# Altium schematic sheet ArcadeJoystick.SchDoc
size A
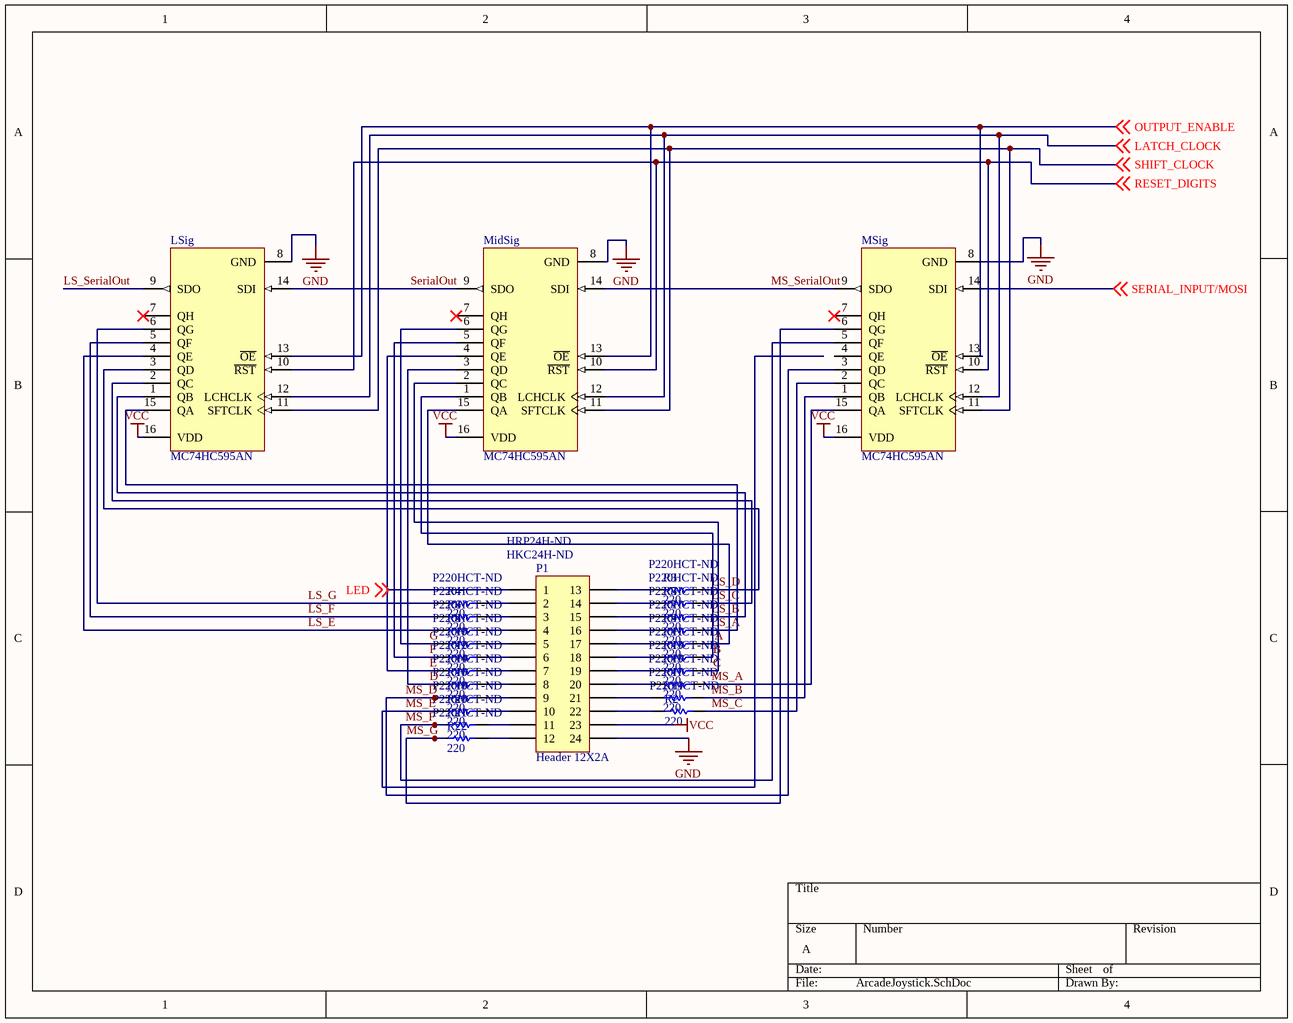
[diagram p0: ArcadeJoystick.SchDoc]

## Parts
LSig  MC74HC595AN  [648-08]
MidSig  MC74HC595AN  [648-08]
MSig  MC74HC595AN  [648-08]
P1  Header 12X2A  Supplier Part Number 1: HKC24H-ND  Supplier Part Number 2: HRP24H-ND  [HDR2X12_CEN]
R2  value 220  Supplier Part Number 1: P220HCT-ND  [1608[0603]]  (hidden comment: Res Semi)
R3  value 220  Supplier Part Number 1: P220HCT-ND  [1608[0603]]  (hidden comment: Res Semi)
R4  value 220  Supplier Part Number 1: P220HCT-ND  [1608[0603]]  (hidden comment: Res Semi)
R5  value 220  Supplier Part Number 1: P220HCT-ND  [1608[0603]]  (hidden comment: Res Semi)
R6  value 220  Supplier Part Number 1: P220HCT-ND  [1608[0603]]  (hidden comment: Res Semi)
R7  value 220  Supplier Part Number 1: P220HCT-ND  [1608[0603]]  (hidden comment: Res Semi)
R8  value 220  Supplier Part Number 1: P220HCT-ND  [1608[0603]]  (hidden comment: Res Semi)
R9  value 220  Supplier Part Number 1: P220HCT-ND  [1608[0603]]  (hidden comment: Res Semi)
R10  value 220  Supplier Part Number 1: P220HCT-ND  [1608[0603]]  (hidden comment: Res Semi)
R11  value 220  Supplier Part Number 1: P220HCT-ND  [1608[0603]]  (hidden comment: Res Semi)
R12  value 220  Supplier Part Number 1: P220HCT-ND  [1608[0603]]  (hidden comment: Res Semi)
R13  value 220  Supplier Part Number 1: P220HCT-ND  [1608[0603]]  (hidden comment: Res Semi)
R14  value 220  Supplier Part Number 1: P220HCT-ND  [1608[0603]]  (hidden comment: Res Semi)
R15  value 220  Supplier Part Number 1: P220HCT-ND  [1608[0603]]  (hidden comment: Res Semi)
R16  value 220  Supplier Part Number 1: P220HCT-ND  [1608[0603]]  (hidden comment: Res Semi)
R17  value 220  Supplier Part Number 1: P220HCT-ND  [1608[0603]]  (hidden comment: Res Semi)
R18  value 220  Supplier Part Number 1: P220HCT-ND  [1608[0603]]  (hidden comment: Res Semi)
R19  value 220  Supplier Part Number 1: P220HCT-ND  [1608[0603]]  (hidden comment: Res Semi)
R20  value 220  Supplier Part Number 1: P220HCT-ND  [1608[0603]]  (hidden comment: Res Semi)
R21  value 220  Supplier Part Number 1: P220HCT-ND  [1608[0603]]  (hidden comment: Res Semi)
R22  value 220  Supplier Part Number 1: P220HCT-ND  [1608[0603]]  (hidden comment: Res Semi)

## Nets
GND: LSig.8(GND) MidSig.8(GND) MSig.8(GND) P1.24
VCC: LSig.16(VDD) MidSig.16(VDD) MSig.16(VDD) P1.23
A: MidSig.15(QA) R11.2
B: MidSig.1(QB) R13.2
C: MidSig.2(QC) R15.2
D: MidSig.3(QD) R16.1
E: MidSig.4(QE) R14.1
F: MidSig.5(QF) R12.1
G: MidSig.6(QG) R10.1
LATCH_CLOCK: LSig.12(LCHCLK) MidSig.12(LCHCLK) MSig.12(LCHCLK) ; off-sheet LATCH_CLOCK
LED: P1.1 ; off-sheet LED
LS_A: LSig.15(QA) R9.2
LS_B: LSig.1(QB) R7.2
LS_C: LSig.2(QC) R5.2
LS_D: LSig.3(QD) R3.2
LS_E: LSig.4(QE) R8.1
LS_F: LSig.5(QF) R6.1
LS_G: LSig.6(QG) R4.1
LS_SerialOut: LSig.9(SDO)
MS_A: MSig.15(QA) R17.2
MS_B: MSig.1(QB) R19.2
MS_C: MSig.2(QC) R2.2
MS_D: MSig.3(QD) R18.1
MS_E: R20.1
MS_F: MSig.5(QF) R21.1
MS_G: MSig.6(QG) R22.1
MS_SerialOut: MidSig.14(SDI) MSig.9(SDO)
OUTPUT_ENABLE: LSig.13(~{OE}) MidSig.13(~{OE}) MSig.13(~{OE}) ; off-sheet OUTPUT_ENABLE
RESET_DIGITS: LSig.10(~{RST}) MidSig.10(~{RST}) MSig.10(~{RST}) ; off-sheet RESET_DIGITS
SERIAL_INPUT/MOSI: MSig.14(SDI) ; off-sheet SERIAL_INPUT/MOSI
SerialOut: LSig.14(SDI) MidSig.9(SDO)
SHIFT_CLOCK: LSig.11(SFTCLK) MidSig.11(SFTCLK) MSig.11(SFTCLK) ; off-sheet SHIFT_CLOCK
NetP1_2: P1.2 R4.2
NetP1_3: P1.3 R6.2
NetP1_4: P1.4 R8.2
NetP1_5: P1.5 R10.2
NetP1_6: P1.6 R12.2
NetP1_7: P1.7 R14.2
NetP1_8: P1.8 R16.2
NetP1_9: P1.9 R18.2
NetP1_10: P1.10 R20.2
NetP1_11: P1.11 R21.2
NetP1_12: P1.12 R22.2
NetP1_13: P1.13 R3.1
NetP1_14: P1.14 R5.1
NetP1_15: P1.15 R7.1
NetP1_16: P1.16 R9.1
NetP1_17: P1.17 R11.1
NetP1_18: P1.18 R13.1
NetP1_19: P1.19 R15.1
NetP1_20: P1.20 R17.1
NetP1_21: P1.21 R19.1
NetP1_22: P1.22 R2.1

Not connected (* = marked no-connect by the designer): LSig 7(QH)*; MidSig 7(QH)*; MSig 4(QE) 7(QH)*

## Library data of the parts
LSig MidSig MSig = MC74HC595AN: 8-Bit Serial-Input/Serial or Prallel-Output Shift Register with Latched 3-State Outputs; Published: 15-Apr-2002; DatasheetVersion: Mar-2000; PackageVersion: Apr-2000; PackageReference: 648-08; Publisher: Altium Limited; PackageDescription: DIP; 16 Leads; Row Spacing 7.62 mm; Pitch 2.54 mm; Code_JEDEC: MS-001-BB; ComponentLink1Description: Manufacturer Link; ComponentLink1URL: http://www.onsemi.com/; ComponentLink2Description: Datasheet; ComponentLink2URL: http://www.onsemi.com/pub/Collateral/MC74HC595A-D.PDF
P1 = Header 12X2A: Header, 12-Pin, Dual row; LatestRevisionDate: 17-Jul-2002; LatestRevisionNote: Re-released for DXP Platform.; Publisher: Altium Limited; Supplier 1: Digi-Key; Supplier 2: Digi-Key
R2-R22 = Res Semi: Semiconductor Resistor; Published: 8-Jun-2000; LatestRevisionDate: 17-Jul-2002; LatestRevisionNote: Re-released for DXP Platform.; PackageReference: AXIAL-0.5; Publisher: Altium Limited; PackageDescription: Axial Device, Thru-Hole; 2 Leads; 0.5 in Pin Spacing; Supplier 1: Digi-Key